# EAGLE design furby_shield_v1 (EAGLE 6.3)
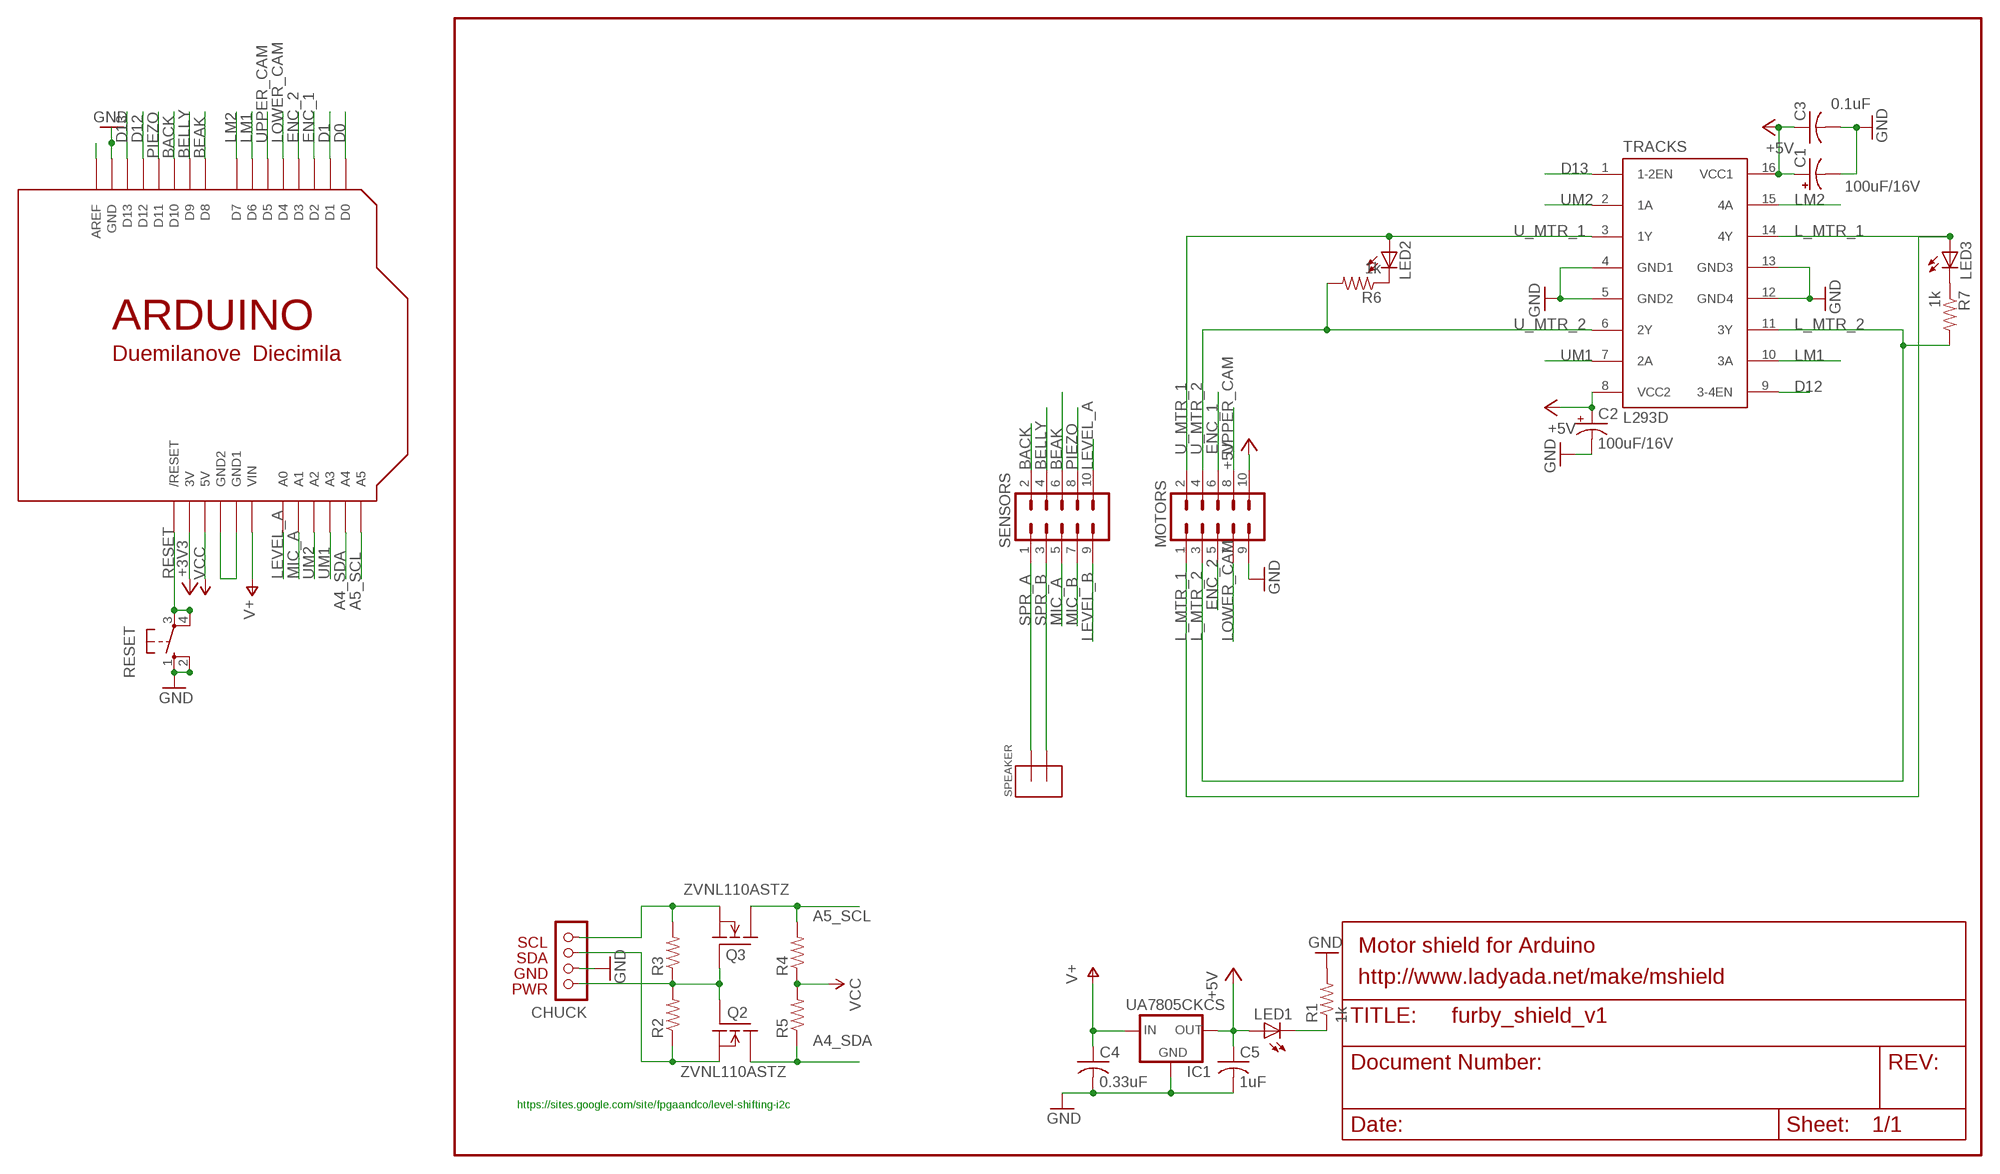
[diagram p0: schematic, sheet 1]

## Parts
C1  100uF/16V  CPOL-USE2.5-6  [E2,5-6]
C2  100uF/16V  CPOL-USE2.5-6  [E2,5-6]
C3  0.1uF  C-US025-025X050  [C025-025X050]
C4  0.33uF  C-US025-024X044  [C025-024X044]
C5  1uF  C-US025-024X044  [C025-024X044]
CHUCK  NUNCHUCK  [CONN]
IC1  UA7805CKCS  V_REG_78XX-TO-220  [TO-220-ALT]
LED1  LED3MM  [LED3MM]
LED2  LED3MM  [LED3MM]
LED3  LED3MM  [LED3MM]
MOTORS  M05X2SHD  [2X5-SHROUDED]
Q2  ZVNL110ASTZ  FQN1N50CI  [TO92-INLINE]
Q3  ZVNL110ASTZ  FQN1N50CI  [TO92-INLINE]
R1  1k  R-US_0204/5  [0204/5]
R2  R-US_0204/7  [0204/7]
R3  R-US_0204/7  [0204/7]
R4  R-US_0204/7  [0204/7]
R5  R-US_0204/7  [0204/7]
R6  1k  R-US_0204/5  [0204/5]
R7  1k  R-US_0204/5  [0204/5]
RESET  10-XX  [B3F-10XX]
SENSORS  M05X2SHD  [2X5-SHROUDED]
SPEAKER  TERMINAL2  [TERMINAL_2]
TRACKS  L293D  L293E  [DIL16]
U$1  ARDUINO-NOHOLE  [ARDUINO-NOHOLE]

## Nets
+3V3: CHUCK.PWR Q2.2(G) Q3.2(G) R2.2 R3.1 U$1.3V
+5V: C1.+ C2.+ C3.1 C5.1 IC1.OUT LED1.A MOTORS.10 TRACKS.8(VCC2) TRACKS.16(VCC1)
A4_SDA: Q2.1(D) R5.1 U$1.A4
A5_SCL: Q3.1(D) R4.2 U$1.A5
BACK: SENSORS.2 U$1.D10
BEAK: SENSORS.6 U$1.D8
BELLY: SENSORS.4 U$1.D9
D0: U$1.D0
D1: U$1.D1
D12: TRACKS.9(3-4EN) U$1.D12
D13: TRACKS.1(1-2EN) U$1.D13
ENC_1: MOTORS.6 U$1.D2
ENC_2: MOTORS.5 U$1.D3
GND [power]: C1.- C2.- C3.2 C4.2 C5.2 CHUCK.GND IC1.GND MOTORS.9 R1.2 RESET.1(S) RESET.2(S1) TRACKS.4(GND1) TRACKS.5(GND2) TRACKS.12(GND4) TRACKS.13(GND3) U$1.GND U$1.GND1 U$1.GND2
L_MTR_1: LED3.A MOTORS.1 TRACKS.14(4Y)
L_MTR_2: MOTORS.3 R7.2 TRACKS.11(3Y)
LEVEL_A: SENSORS.10 U$1.A0
LEVEL_B: SENSORS.9
LM1: TRACKS.10(3A) U$1.D6
LM2: TRACKS.15(4A) U$1.D7
LOWER_CAM: MOTORS.7 U$1.D4
MIC_A: SENSORS.5 U$1.A1
MIC_B: SENSORS.7
N$1: LED2.K(C) R6.1
N$2: LED1.K(C) R1.1
N$3: LED3.K(C) R7.1
PIEZO: SENSORS.8 U$1.D11
RESET: RESET.3(P) RESET.4(P1) U$1.RESET(/RESET)
SCL: CHUCK.SCL Q3.3(S) R3.2
SDA: CHUCK.SDA Q2.3(S) R2.1
SPR_A: SENSORS.1 SPEAKER.P$1
SPR_B: SENSORS.3 SPEAKER.P$2
U_MTR_1: LED2.A MOTORS.2 TRACKS.3(1Y)
U_MTR_2: MOTORS.4 R6.2 TRACKS.6(2Y)
UM1: TRACKS.7(2A) U$1.A3
UM2: TRACKS.2(1A) U$1.A2
UPPER_CAM: MOTORS.8 U$1.D5
V+: C4.1 IC1.IN U$1.VIN
VCC: R4.1 R5.2 U$1.5V U$1.AREF

## Notes on the sheet
- Motor shield for Arduino
- http://www.ladyada.net/make/mshield
- https://sites.google.com/site/fpgaandco/level-shifting-i2c

## Library data of the parts
C1 C2 = rcl-ez:CPOL-US: POLARIZED CAPACITOR, American symbol
C3 = rcl-ez:C-US: CAPACITOR, American symbol
C4 C5 = adafruit:C-US: CAPACITOR, American symbol
CHUCK = _my-parts:NUNCHUCK
IC1 = SparkFun:V_REG_78XX: Voltage Regulator Standard 7805 5V regulator. IGO (Input Ground Output). Spark Fun Electronics SKU : COM-00107
LED1-LED3 = adafruit:LED: LED OSRAM: - CHIPLED LG R971, LG N971, LY N971, LG Q971, LY Q971, LO R971, LY R971 LH N974, LH R974 LS Q976, LO Q976, LY Q976 LO Q996 - Hyper CHIPLED LW Q18S LB Q993, LB Q99A, LB R99A - SideLED LS A670, LO A670, LY A670, LG A670, LP A670 LB A673, LV A673, LT A673, LW A673 LH A674 LY A675 LS A676, LA A676, LO A676, LY A676, LW A676 LS A679, LY A679, LG A679 - Hyper Micro SIDELED® LS Y876, LA Y876, LO Y876, LY Y876 LT Y87S - SmartLED LW L88C, LW L88S LB L89C, LB L89S, LG L890 LS L89K, LO L89K, LY L89K LS L896, LA L896, LO L896, LY L896 - TOPLED LS T670, LO T670, LY T670, LG T670, LP T670 LSG T670, LSP T670, LSY T670, LOP T670, LYG T670 LG T671, LOG T671, LSG T671 LB T673, LV T673, LT T673, LW T673 LH T674 LS T676, LA T676, LO T676, LY T676, LB T676, LH T676, LSB T676, LW T676 LB T67C, LV T67C, LT T67C, LS T67K, LO T67K, LY T67K, LW E67C LS E67B, LA E67B, LO E67B, LY E67B, LB E67C, LV E67C, LT E67C LW T67C LS T679, LY T679, LG T679 LS T770, LO T770, LY T770, LG T770, LP T770 LB T773, LV T773, LT T773, LW T773 LH T774 LS E675, LA E675, LY E675, LS T675 LS T776, LA T776, LO T776, LY T776, LB T776 LHGB T686 LT T68C, LB T68C - Hyper Mini TOPLED® LB M676 - Mini TOPLED Santana® LG M470 LS M47K, LO M47K, LY M47K Source: http://www.osram.convergy.de/
MOTORS SENSORS = SparkFun_mod:M05X2: Header 5x2 Standard 10-pin dual row 0.1" header. Commonly used with AVR-ISP. Use with Spark Fun Electronics SKU: PRT-00778
Q2 Q3 = adafruit:FQN1N50C: N-Channel Enhancement MOSFET 500V, 0.4A, 6.0 Ohm
R1-R7 = adafruit:R-US_: RESISTOR, American symbol
RESET = switch-omron:10-XX: OMRON SWITCH
SPEAKER = _my-parts:TERMINAL2
TRACKS = texas:L293E: TI DEVICE
U$1 = adafruit:ARDUINO: Arduino Diecimila/Duemilanove Make a shield with ease, this package has all the named pins as well as the two mounting drill holes and an outline of the USB and DC power connector. The outline is on the DIMENSION layer, so if your board house uses it they will cut the outline to match. http://www.ladyada.net/library/pcb/eaglelibrary.html

## Net classes
0 default: width 0.203 mm
1 power: width 0.61 mm

## Board
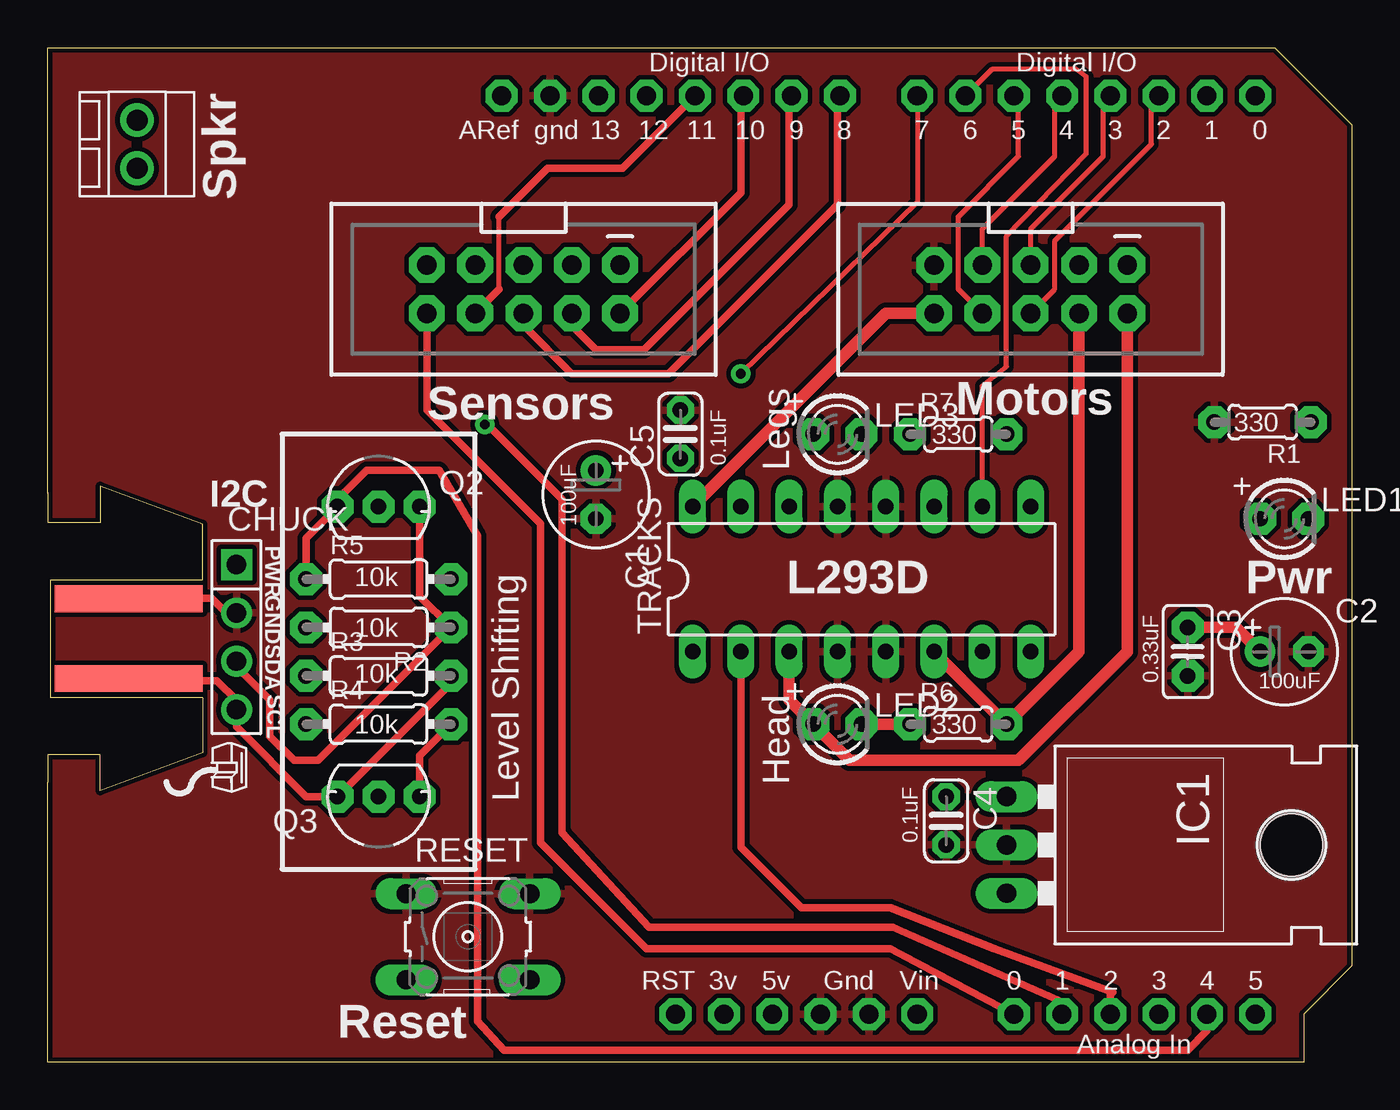
[diagram p1: board, top side]
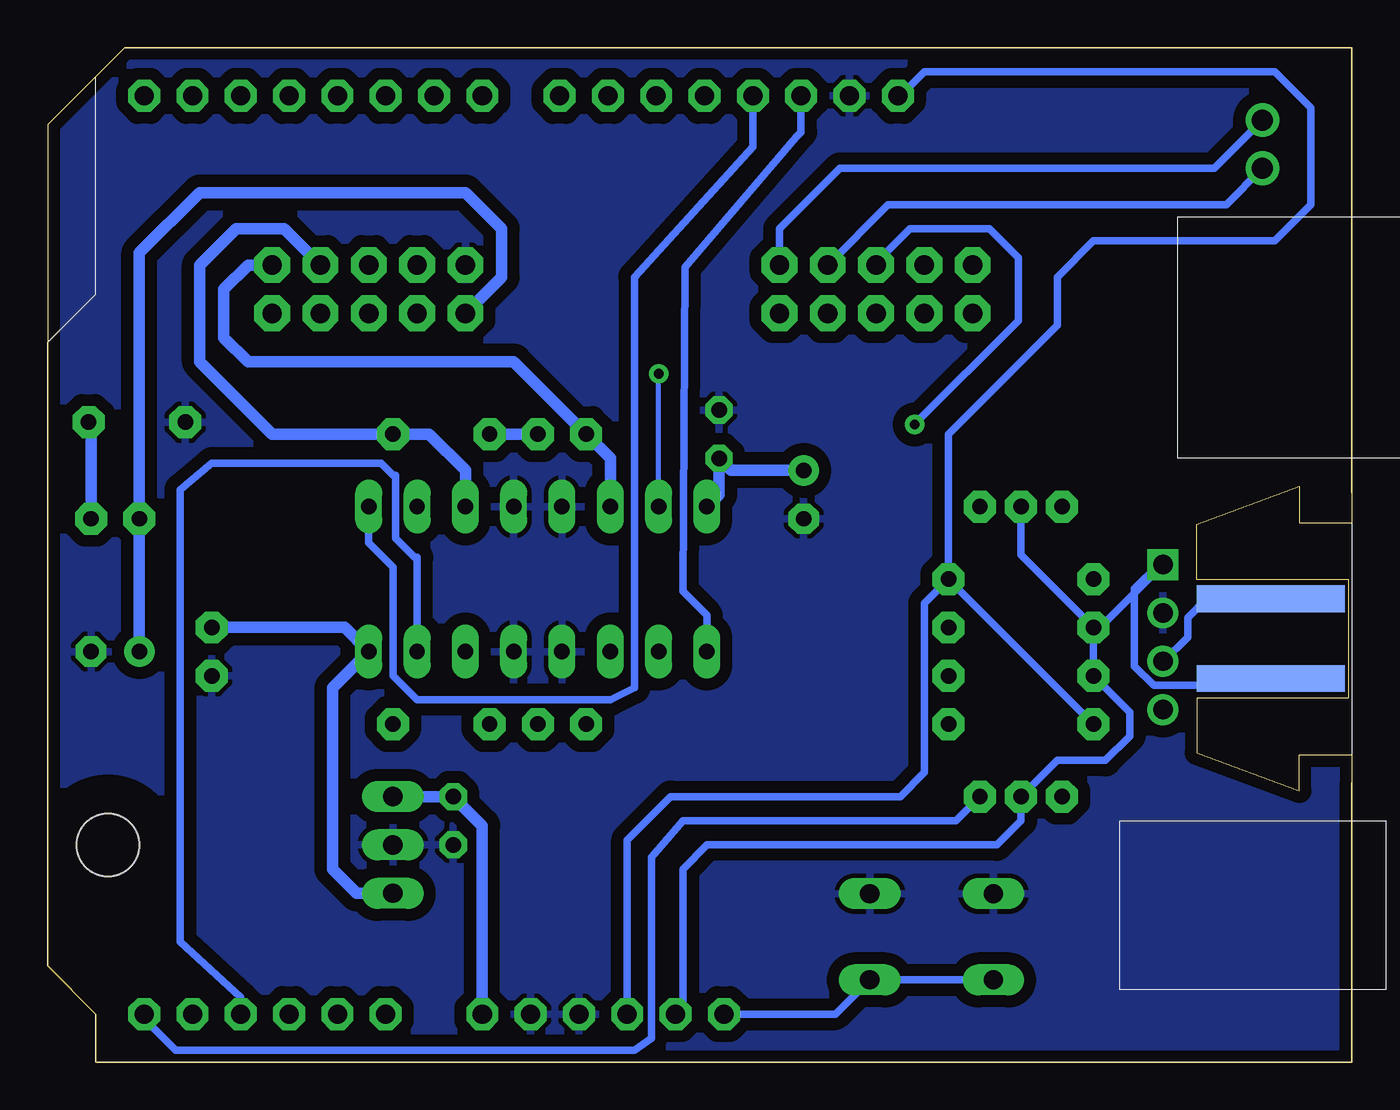
[diagram p2: board, bottom side, seen from below]

Size 68.59 x 53.34 mm. Coordinates in mm from the lower left corner, seen from the top.
Outline: 0.01,14.73 0.01,0 66.05,0 66.05,2.54 68.59,5.08 68.59,49.28 64.52,53.34 0.01,53.34 0.01,29.91
Copper layers (1*16): Top 0.035mm / dielectric 1.5mm / Bottom 0.035mm
Design rules "SparkFun": minimum track width 8mil, minimum drill 20mil, track to track 8mil, track to pad 8mil, pad to pad 8mil, via to via 8mil, smd to smd 8mil, copper to edge 10mil, drill to drill 8mil, minimum pad ring 12mil, minimum via ring 10mil, stop-mask expansion 4mil, vias tented up to drill 25mil, thermal gap 10mil

### Footprints (pad centres in the part's own frame; a part is rotated, then mirrored left to right if it is on the bottom)
E2,5-6 = drill 0.813 pad 1.6: + -1.27,0 | drill 0.813 pad 1.6 octagon: - 1.27,0
C025-025X050 = drill 0.813 pad 1.676 octagon: 1 -1.27,0; 2 1.27,0
C025-024X044 = drill 0.813 pad 1.422 octagon: 1 -1.27,0; 2 1.27,0
CONN = drill 1.016: GND -0.23,6.35; SCL -0.23,1.27; SDA -0.23,3.81 | smd 7.8 x 1.4 bottom: P$1_SDA -5.9,7.1; P$4_VCC -5.9,2.9 | smd 7.8 x 1.4: P$2_SCL -5.9,2.9; P$3_GND -5.9,7.1 | drill 1.016 square: PWR -0.23,8.89
TO-220-ALT = drill 1.016 long: GND 0,-3.81; IN -2.54,-3.81; OUT 2.54,-3.81 | hole 3.302: 0,11.176
LED3MM = drill 0.813 pad 1.676 octagon: A -1.27,0; K 1.27,0
2X5-SHROUDED = drill 1.016 pad 1.88 octagon: 1 -1.27,5.08; 2 1.27,5.08; 3 -1.27,2.54; 4 1.27,2.54; 5 -1.27,0; 6 1.27,0; 7 -1.27,-2.54; 8 1.27,-2.54; 9 -1.27,-5.08; 10 1.27,-5.08
TO92-INLINE = drill 0.813 pad 1.676 octagon: 1 -2.159,0; 2 0,0; 3 2.159,0
0204/5 = drill 0.813 pad 1.676 octagon: 1 -2.54,0; 2 2.54,0
0204/7 = drill 0.813 pad 1.676 octagon: 1 -3.81,0; 2 3.81,0
B3F-10XX = drill 1.016 long: 1 -3.251,2.261; 2 3.251,2.261; 3 -3.251,-2.261; 4 3.251,-2.261
TERMINAL_2 = drill 1.1 pad 1.778: P$1 1.27,0; P$2 -1.27,0
DIL16 = drill 0.813 long: 1 -8.89,-3.81; 2 -6.35,-3.81; 3 -3.81,-3.81; 4 -1.27,-3.81; 5 1.27,-3.81; 6 3.81,-3.81; 7 6.35,-3.81; 8 8.89,-3.81; 9 8.89,3.81; 10 6.35,3.81; 11 3.81,3.81; 12 1.27,3.81; 13 -1.27,3.81; 14 -3.81,3.81; 15 -6.35,3.81; 16 -8.89,3.81
ARDUINO-NOHOLE = drill 1 pad 1.676 octagon: 3V 35.56,2.54; 5V 38.1,2.54; A0 50.8,2.54; A1 53.34,2.54; A2 55.88,2.54; A3 58.42,2.54; A4 60.96,2.54; A5 63.5,2.54; AREF 23.876,50.8; D0 63.5,50.8; D1 60.96,50.8; D2 58.42,50.8; D3 55.88,50.8; D4 53.34,50.8; D5 50.8,50.8; D6 48.26,50.8; D7 45.72,50.8; D8 41.656,50.8; D9 39.116,50.8; D10 36.576,50.8; D11 34.036,50.8; D12 31.496,50.8; D13 28.956,50.8; GND 26.416,50.8; GND1 43.18,2.54; GND2 40.64,2.54; RESET 33.02,2.54; VIN 45.72,2.54

### Placement (x,y rotation side)
C1  28.83,29.84 270 top
C2  65.03,21.59 0 top
C3  59.95,21.59 270 top
C4  47.25,12.7 270 top
C5  33.28,33.02 90 top
CHUCK  10.17,17.27 0 top
IC1  54.23,11.43 270 top
LED1  65.03,28.57 0 top
LED2  41.53,17.78 0 top
LED3  41.53,33.02 0 top
MOTORS  51.69,40.64 270 top
Q2  17.4,29.21 0 top
Q3  17.4,13.97 180 top
R1  63.89,33.66 180 top
R2  17.4,22.86 180 top
R3  17.4,20.32 0 top
R4  17.4,17.78 0 top
R5  17.4,25.4 0 top
R6  47.88,17.78 0 top
R7  47.88,33.02 0 top
RESET  22.1,6.6 0 top
SENSORS  25.02,40.64 270 top
SPEAKER  4.7,48.26 90 top
TRACKS  42.8,25.4 0 top
U$1  0.01,0 0 top

### Tracks (layer width: path | path; a pad name or v marks a point on that pad's centre or on a via)
+3V3
  Bottom 0.406: R2.2 R3.1 11.69,18.41 11.69,17.14 12.96,15.88 15.5,15.88 Q3.2 17.4,12.7 18.67,11.43 33.91,11.43 35.18,10.16 35.18,2.92 U$1.3V | R2.2 17.4,26.67 Q2.2 | R2.2 13.24,22.86 CHUCK.PWR
+5V
  Top 0.61: MOTORS.10 44.07,39.37 TRACKS.16 | C3.1 62.49,22.86 C2.+
  Bottom 0.61: MOTORS.10 44.71,41.27 44.71,43.81 46.61,45.72 60.58,45.72 63.76,42.55 LED1.A C2.+ | IC1.OUT 52.33,8.89 53.6,10.16 53.6,19.68 TRACKS.8 52.96,22.86 C3.1 | C1.+ 32.64,31.11 C5.1 33.28,29.84 TRACKS.16
A4_SDA
  Top 0.406: R5.1 13.59,27.56 Q2.1 15.5,29.46 15.5,29.84 16.77,31.11 20.58,31.11 22.61,27.69 22.61,2.16 24.01,0.64 59.95,0.64 60.97,1.65 U$1.A4
A5_SCL
  Top 0.406: Q3.1 19.56,16.13 R4.2
  Bottom 0.406: U$1.A5 63.51,2.29 61.85,0.64 37.72,0.64 36.84,1.27 36.84,10.79 35.18,12.7 20.83,12.7 Q3.1
BACK
  Top 0.406: SENSORS.2 36.45,45.72 36.45,50.67 U$1.D10
BEAK
  Top 0.406: SENSORS.6 25.02,38.73 27.56,36.2 32.64,36.2 41.53,45.09 41.53,50.67 U$1.D8
BELLY
  Top 0.406: SENSORS.4 27.56,38.73 28.83,37.47 31.37,37.47 38.99,45.09 38.99,50.67 U$1.D9
D12
  Bottom 0.406: U$1.D12 31.5,48.13 37.72,41.27 37.72,19.68 38.99,19.05 49.15,19.05 50.42,20.32 50.42,26.04 51.69,27.3 TRACKS.9
D13
  Bottom 0.406: TRACKS.1 33.91,23.5 35.18,24.77 35.06,41.78 29.22,48.64 28.96,48.9 U$1.D13
ENC_1
  Top 0.254: MOTORS.6 52.96,40.64 52.96,43.18 58.04,48.26 58.04,50.42 U$1.D2
ENC_2
  Top 0.254: MOTORS.5 51.69,43.81 55.5,47.62 55.5,50.42 U$1.D3
GND
  pour Bottom (isolate 0.635): -5.07,58.42 71.13,58.42 71.13,-3.05 -5.07,-3.17
  pour Top (isolate 0.254): -3.8,57.15 69.6,57.53 69.98,-1.65 -3.8,-1.65
L_MTR_1
  Bottom 0.61: TRACKS.14 38.99,31.75 LED3.A 44.07,36.83 58.04,36.83 59.31,38.1 59.31,40.64 58.04,41.91 MOTORS.1
L_MTR_2
  Bottom 0.61: TRACKS.11 46.61,31.11 48.52,33.02 R7.2 56.77,33.02 60.58,36.83 60.58,41.91 58.68,43.81 56.14,43.81 MOTORS.3
LEVEL_A
  Top 0.406: SENSORS.10 19.94,34.29 25.91,28.32 25.91,11.56 31.5,5.97 44.33,5.97 U$1.A0
LM1
  Top 0.254: TRACKS.10 49.15,35.56 50.42,36.58 50.42,43.43 54.62,47.75 54.62,51.82 54.11,52.2 49.66,52.2 U$1.D6
LM2  (via drill 0.51)
  Top 0.254: U$1.D7 45.73,45.21 v36.45,36.2
  Bottom 0.254: TRACKS.15 v36.45,36.2
LOWER_CAM
  Top 0.254: MOTORS.7 49.15,43.81 52.96,47.62 52.96,50.42 U$1.D4
MIC_A  (via drill 0.51)
  Top 0.406: U$1.A1 53.35,3.17 44.46,7.11 31.63,7.11 27.06,12.06 27.06,29.59 23.12,33.53
  Top 0.61: 23.12,33.53 v22.99,33.53
  Bottom 0.406: SENSORS.5 25.02,42.04 23.25,43.81 19.06,43.81 17.53,42.29 17.53,38.99 v22.99,33.53
N$1
  Top 0.61: LED2.K R6.1
N$2
  Bottom 0.61: LED1.K 66.3,33.53 R1.1
N$3
  Bottom 0.61: LED3.K R7.1
PIEZO
  Top 0.254: 23.75,40.64 23.75,44.45
  Top 0.406: SENSORS.8 23.75,40.64 | 23.75,44.45 26.29,46.99 30.23,46.99 U$1.D11
RESET
  Bottom 0.406: U$1.RESET 27.16,2.54 RESET.4 RESET.3
SCL
  Top 0.406: CHUCK.SCL 9.94,17.63 13.59,13.97 Q3.3 | Q3.3 15.25,14.35 | R3.2 21.21,19.94 Q3.3
SDA
  Top 0.406: Q2.3 19.56,24.51 R2.1 14.23,15.88 12.96,15.88 11.69,17.14 11.69,19.05 9.94,20.8 CHUCK.SDA
SPR_A
  Bottom 0.406: SENSORS.1 30.1,43.81 26.93,46.99 7.24,46.99 SPEAKER.P$1
SPR_B
  Bottom 0.406: SPEAKER.P$2 6.61,45.09 24.39,45.09 SENSORS.3
U_MTR_1
  Top 0.61: TRACKS.3 38.99,19.05 LED2.A 42.17,15.88 51.06,15.88 56.77,21.59 MOTORS.2
U_MTR_2
  Top 0.61: TRACKS.6 R6.2 54.23,21.59 MOTORS.4
UM1
  Bottom 0.406: U$1.A3 58.43,3.43 61.6,6.35 61.6,30.1 59.95,31.5 51.06,31.5 50.42,30.86 50.3,30.86 50.3,27.56 49.28,26.54 49.15,26.54 TRACKS.7
UM2
  Top 0.406: U$1.A2 55.89,3.56 56.01,3.68 49.79,5.97 44.33,8.13 39.63,8.13 36.45,11.3 TRACKS.2
UPPER_CAM
  Top 0.254: MOTORS.8 47.88,40.64 47.88,44.45 51.06,47.62 51.06,50.55 U$1.D5
V+
  Bottom 0.61: U$1.VIN 45.73,12.45 C4.1 IC1.IN
VCC
  Bottom 0.406: R4.1 R5.2 | U$1.AREF 23.75,50.8 22.48,52.07 4.07,52.07 2.16,50.16 2.16,45.09 4.07,43.18 13.59,43.18 15.5,41.27 15.5,38.73 21.21,33.02 R5.2 | U$1.5V 38.11,11.68 35.82,13.97 23.75,13.97 22.48,15.24 22.48,24.13 R5.2

### Text on the board
tPlace: Spkr | Sensors | Motors | 330 | 330 | 0.1uF | Legs | I2C | 100uF | 10k | L293D | Pwr | 10k | 10k | 0.33uF | 100uF | 10k | 330 | Head | Level Shifting | 0.1uF | Reset